# EAGLE schematic arduino isp v2 (EAGLE 6.4)
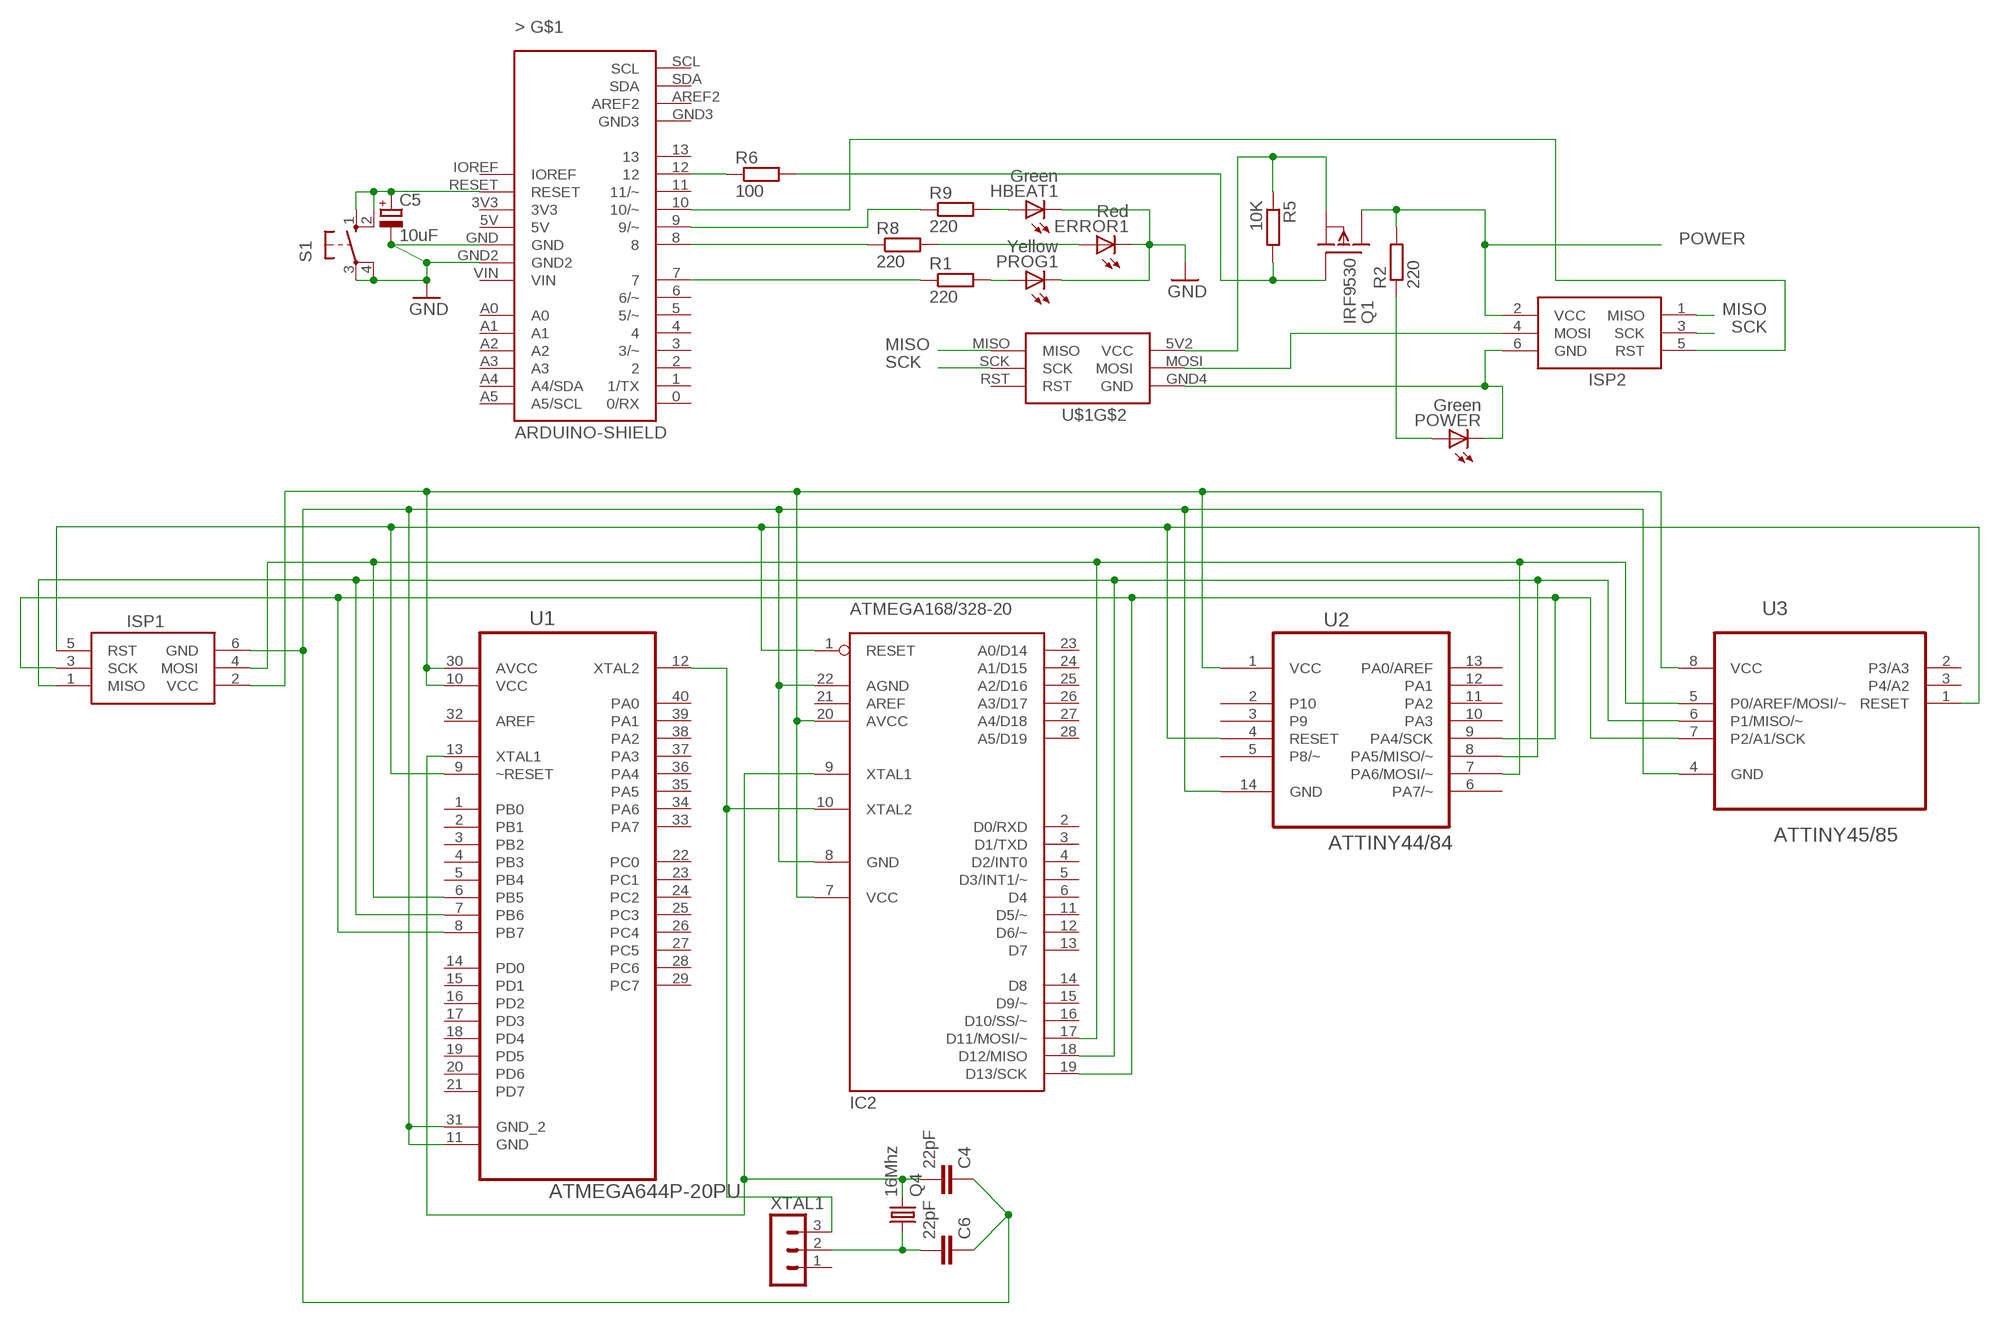
[diagram p0: schematic, sheet 1]

## Parts
C4  22pF  C-EU050-030X075  [C050-030X075]
C5  10uF  CPOL-EUE2,5-6E  [E2,5-6E]
C6  22pF  C-EU050-030X075  [C050-030X075]
ERROR1  Red  LED5MM  [LED5MM]
HBEAT1  Green  LED5MM  [LED5MM]
IC2  ATMEGA168/328-20  [DIL28-3]
ISP1  AVRISP-6  [AVRISP]
ISP2  AVRISP-6  [AVRISP]
POWER  Green  LED5MM  [LED5MM]
PROG1  Yellow  LED5MM  [LED5MM]
Q1  IRF9530  [TO220]
Q4  16Mhz  CRYSTALHC49S  [HC49/S]
R1  220  R-EU_0207/10  [0207/10]
R2  220  R-EU_0207/10  [0207/10]
R5  10K  R-EU_0207/10  [0207/10]
R6  100  R-EU_0207/10  [0207/10]
R8  220  R-EU_0207/10  [0207/10]
R9  220  R-EU_0207/10  [0207/10]
S1  10-XX  [B3F-10XX]
U1  ATMEGA644P-20PU  [DIP254P1524X482-40]
U2  ATTINY44/84  [DIP254P762X533-14]
U3  ATTINY45/85  [DIP254P762X533-8]
U$1  ARDUINO-SHIELD  [ARDUINO-UNO-SHIELD]
XTAL1  MA03-1  [MA03-1]

## Nets
GND: C5.- ERROR1.K(C) HBEAT1.K(C) PROG1.K(C) S1.3(P) S1.4(P1) U$1.GND U$1.GND2
MISO: ISP2.1(MISO) U$1.MISO
N$1: Q1.3(S) R5.1 U$1.5V2(VCC)
N$2: ISP2.6(GND) POWER.K(C) U$1.GND4(GND)
N$4: R6.1 U$1.12
N$5: ISP2.4(MOSI) U$1.MOSI
N$6: Q1.1(G) R5.2 R6.2
N$7: IC2.7(VCC) IC2.20(AVCC) ISP1.2(VCC) U1.10(VCC) U1.30(AVCC) U2.1(VCC) U3.8(VCC)
N$8: POWER.A R2.1
N$9: IC2.1(RESET) ISP1.5(RST) U1.9(~RESET) U2.4(RESET) U3.1(RESET)
N$10: IC2.17(D11/MOSI/~) ISP1.4(MOSI) U1.6(PB5) U2.7(PA6/MOSI/~) U3.5(P0/AREF/MOSI/~)
N$11: IC2.18(D12/MISO) ISP1.1(MISO) U1.7(PB6) U2.8(PA5/MISO/~) U3.6(P1/MISO/~)
N$12: IC2.19(D13/SCK) ISP1.3(SCK) U1.8(PB7) U2.9(PA4/SCK) U3.7(P2/A1/SCK)
N$13: ISP2.5(RST) U$1.10(10/~)
N$19: PROG1.A R1.2
N$20: R8.1 U$1.8
N$24: R1.1 U$1.7
N$25: ERROR1.A R8.2
N$26: HBEAT1.A R9.2
N$27: R9.1 U$1.9(9/~)
N$30: IC2.10(XTAL2) U1.12(XTAL2) XTAL1.3
N$31: C6.2 Q4.1 XTAL1.2
N$32: C4.1 C6.1 IC2.8(GND) IC2.22(AGND) ISP1.6(GND) U1.11(GND) U1.31(GND_2) U2.14(GND) U3.4(GND)
N$33: C4.2 IC2.9(XTAL1) Q4.2 U1.13(XTAL1)
POWER: ISP2.2(VCC) Q1.2(D) R2.2
RESET: C5.+ S1.1(S) S1.2(S1) U$1.RESET
SCK: ISP2.3(SCK) U$1.SCK
Unconnected: IC2.2(D0/RXD) IC2.3(D1/TXD) IC2.4(D2/INT0) IC2.5(D3/INT1/~) IC2.6(D4) IC2.11(D5/~) IC2.12(D6/~) IC2.13(D7) IC2.14(D8) IC2.15(D9/~) IC2.16(D10/SS/~) IC2.21(AREF) IC2.23(A0/D14) IC2.24(A1/D15) IC2.25(A2/D16) IC2.26(A3/D17) IC2.27(A4/D18) IC2.28(A5/D19) U1.1(PB0) U1.2(PB1) U1.3(PB2) U1.4(PB3) U1.5(PB4) U1.14(PD0) U1.15(PD1) U1.16(PD2) U1.17(PD3) U1.18(PD4) U1.19(PD5) U1.20(PD6) U1.21(PD7) U1.22(PC0) U1.23(PC1) U1.24(PC2) U1.25(PC3) U1.26(PC4) U1.27(PC5) U1.28(PC6) U1.29(PC7) U1.32(AREF) U1.33(PA7) U1.34(PA6) U1.35(PA5) U1.36(PA4) U1.37(PA3) U1.38(PA2) U1.39(PA1) U1.40(PA0) U2.2(P10) U2.3(P9) U2.5(P8/~) U2.6(PA7/~) U2.10(PA3) U2.11(PA2) U2.12(PA1) U2.13(PA0/AREF) U3.2(P3/A3) U3.3(P4/A2) U$1.0(0/RX) U$1.1(1/TX) U$1.2 U$1.3(3/~) U$1.3V3 U$1.4 U$1.5(5/~) U$1.5V U$1.6(6/~) U$1.11(11/~) U$1.13 U$1.A0 U$1.A1 U$1.A2 U$1.A3 U$1.A4(A4/SDA) U$1.A5(A5/SCL) U$1.AREF2 U$1.GND3 U$1.IOREF U$1.RST U$1.SCL U$1.SDA U$1.VIN XTAL1.1

## Library data of the parts
C4 C6 = rcl:C-EU: CAPACITOR, European symbol
C5 = rcl:CPOL-EU: POLARIZED CAPACITOR, European symbol
ERROR1 HBEAT1 POWER PROG1 = adafruit:LED: LED OSRAM: - CHIPLED LG R971, LG N971, LY N971, LG Q971, LY Q971, LO R971, LY R971 LH N974, LH R974 LS Q976, LO Q976, LY Q976 LO Q996 - Hyper CHIPLED LW Q18S LB Q993, LB Q99A, LB R99A - SideLED LS A670, LO A670, LY A670, LG A670, LP A670 LB A673, LV A673, LT A673, LW A673 LH A674 LY A675 LS A676, LA A676, LO A676, LY A676, LW A676 LS A679, LY A679, LG A679 - Hyper Micro SIDELED® LS Y876, LA Y876, LO Y876, LY Y876 LT Y87S - SmartLED LW L88C, LW L88S LB L89C, LB L89S, LG L890 LS L89K, LO L89K, LY L89K LS L896, LA L896, LO L896, LY L896 - TOPLED LS T670, LO T670, LY T670, LG T670, LP T670 LSG T670, LSP T670, LSY T670, LOP T670, LYG T670 LG T671, LOG T671, LSG T671 LB T673, LV T673, LT T673, LW T673 LH T674 LS T676, LA T676, LO T676, LY T676, LB T676, LH T676, LSB T676, LW T676 LB T67C, LV T67C, LT T67C, LS T67K, LO T67K, LY T67K, LW E67C LS E67B, LA E67B, LO E67B, LY E67B, LB E67C, LV E67C, LT E67C LW T67C LS T679, LY T679, LG T679 LS T770, LO T770, LY T770, LG T770, LP T770 LB T773, LV T773, LT T773, LW T773 LH T774 LS E675, LA E675, LY E675, LS T675 LS T776, LA T776, LO T776, LY T776, LB T776 LHGB T686 LT T68C, LB T68C - Hyper Mini TOPLED® LB M676 - Mini TOPLED Santana® LG M470 LS M47K, LO M47K, LY M47K Source: http://www.osram.convergy.de/
IC2 = Webmaster442:ATMEGA168/328: ATMega168/328 DIL package with Arduno style names
ISP1 ISP2 = Webmaster442:AVRISP: AVR ISP HEADER Standard 6 pin header for AVR programming
Q1 = transistor-fet:IRF9530: P-Channel Enhancement MOSFET (HEXFET); -100V; -12A; 0,3Ohm
Q4 = crystal:CRYSTAL: CRYSTAL; OC_FARNELL: 1667008; OC_NEWARK: unknown
R1 R2 R5 R6 R8 R9 = rcl:R-EU_: RESISTOR, European symbol
S1 = switch-omron:10-XX: OMRON SWITCH; MPN: B3F-1000; OC_FARNELL: 176432; OC_NEWARK: 36M3542
U1 = Atmel_By_element14_Batch_1:ATMEGA644P-20PU: 8-bit MCU; MPN: ATMEGA644P-20PU; OC_FARNELL: 1455122; OC_NEWARK: 58M3747; PACKAGE: DIP-40; SUPPLIER: Atmel
U2 = Webmaster442:ATTINY44/84: ATTiny44/84 DIL package with Arduino style names; MPN: ATTINY44-20PU; OC_FARNELL: 1455150; OC_NEWARK: 58M3786; PACKAGE: PDIP-14; SUPPLIER: Atmel
U3 = Webmaster442:ATTINY45/85: ATTiny45/85 DIL package with Arduno style names; MPN: ATTINY45-20PU; OC_FARNELL: 1288352; OC_NEWARK: 23M5072; PACKAGE: PDIP-8; SUPPLIER: Atmel
U$1 = Webmaster442:ARDUINO-SHIELD: Arduino Uno Rev. 3 shield symbol
XTAL1 = con-lstb:MA03-1: PIN HEADER; OC_FARNELL: unknown; OC_NEWARK: unknown